# Altium schematic sheet 5V_to_3V_LDO.SchDoc
size A; SheetNumber: 6; SheetTotal: 7
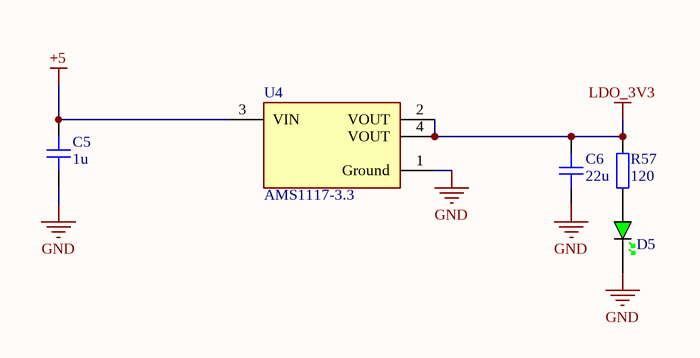
[diagram p0: 5V_to_3V_LDO.SchDoc]

## Parts
C5  1u  [CAP_0402]
C6  22u  [CAP_0402]
D5  GREEN  [LED_0805_GREEN]  (value not drawn)
R57  120  [RES_0805]
U4  AMS1117-3.3  [FP-AMS1117-IPC_C]

## Nets
+5: C5.2 U4.3(VIN)
GND: C5.1 C6.1 D5.K U4.1(Ground)
LDO_3V3: C6.2 R57.2 U4.2(VOUT) U4.4(VOUT)
NetD5_A: D5.A R57.1

## Library data of the parts
C5 C6 = CAP_0402: Capacitor SMD 0402; Manufacturer: *; Manufacturer Part Number: *; Distributor Link: *; Rating: *; Dielectric: *
  C5: LCSC: *; LCSC Part #: C52923
  C6: LCSC Part #: C1621763
D5 = LED_0805_GREEN: KT-0805G; Manufacturer: *; Manufacturer Part Number: *; Distributor Link: *; LCSC: *
R57 = RES_0805: Resistor SMD 0805; Manufacturer: *; Manufacturer Part Number: *; Distributor Link: *; LCSC: *
U4 = CMP-209535-000001-1: LDO Voltage Regulators 1A, 3.3V; Manufacturer: Advanced Monolithic Systems; Dropout Voltage: 1.1V; Output Type: Fixed; Nominal Supply Current: 5mA; Max Power Dissipation: 1.2W; Max Supply Voltage: 15V; Number Of Outputs: 1; Standoff Height: 0.64mm; Max Junction Temp: +125°C; Height: 1.8mm; Package: AMS1117; Device Class L2: Power Management ICs; ComponentLink2Description: Datasheet; ComponentLink2URL: http://www.advanced-monolithic.com/pdf/ds1117.pdf; Category: IC; RoHS: TRUE; Automotive: No; Device Class L1: Integrated Circuits (ICs); Output Current: 1A; Device Class L3: Voltage Regulators - Linear; Temperature: -40°C to +125°C; Output Voltage: 3.3V; Manufacturer Part Number: AMS1117-3.3; Temperature Range Low: -40°C; Octopart: https://octopart.com/ams1117-3.3-advanced+monolithic+systems-25899300; Lead Free: Yes; Ipc Land Pattern Name: SOT229P700X180-4; Temperature Range High: +125°C